# EAGLE design PCB-CARDLOCK (EAGLE 6.5.0)

## Sheet 1 of 2
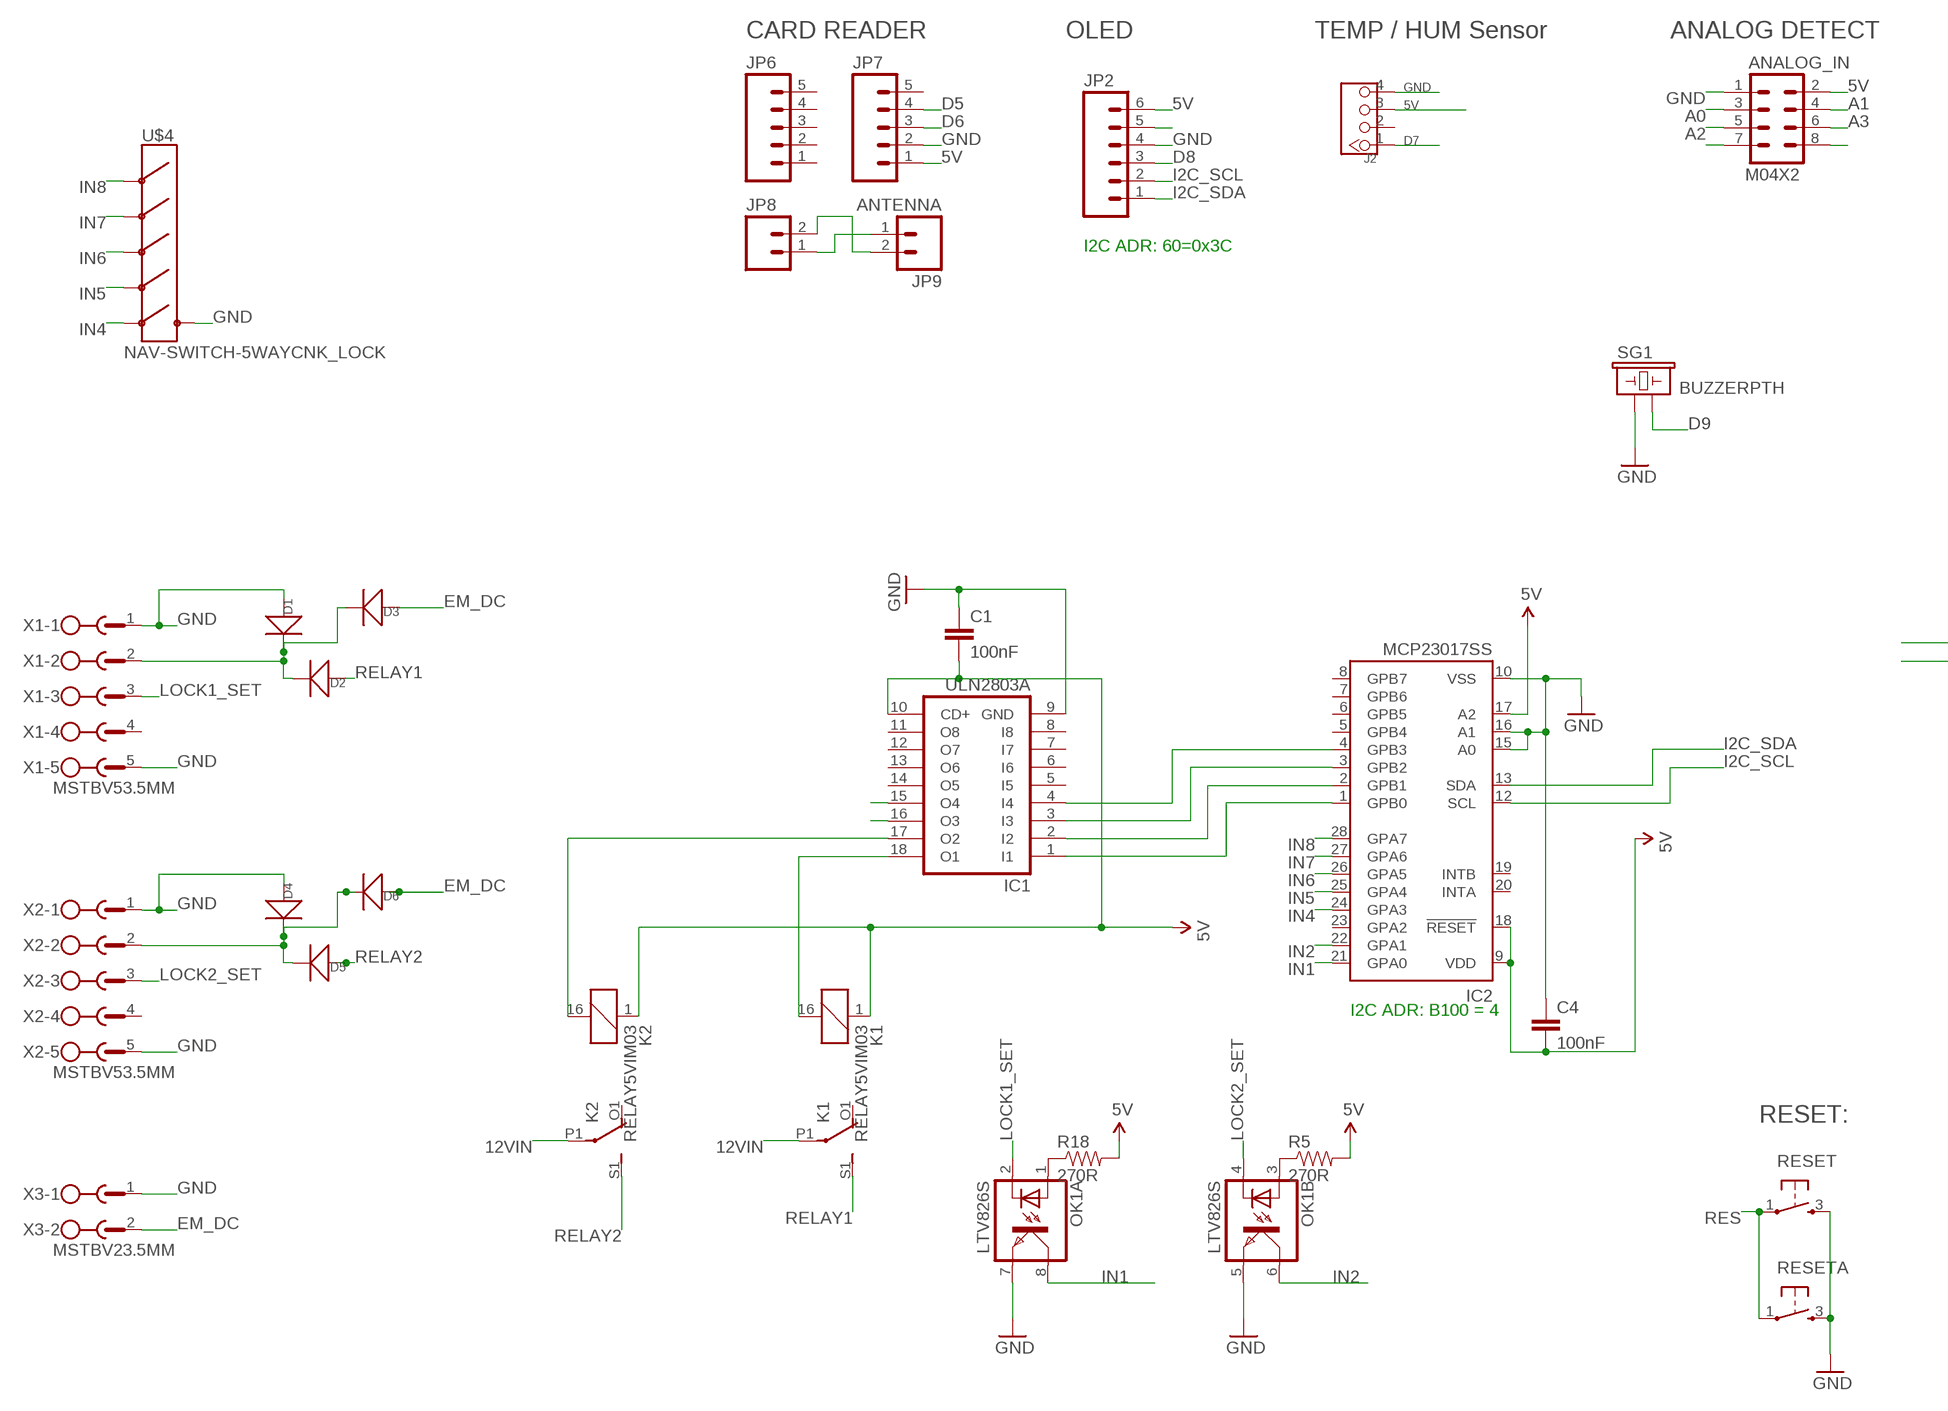
[diagram p0: schematic, sheet 1, part 1 of 2]
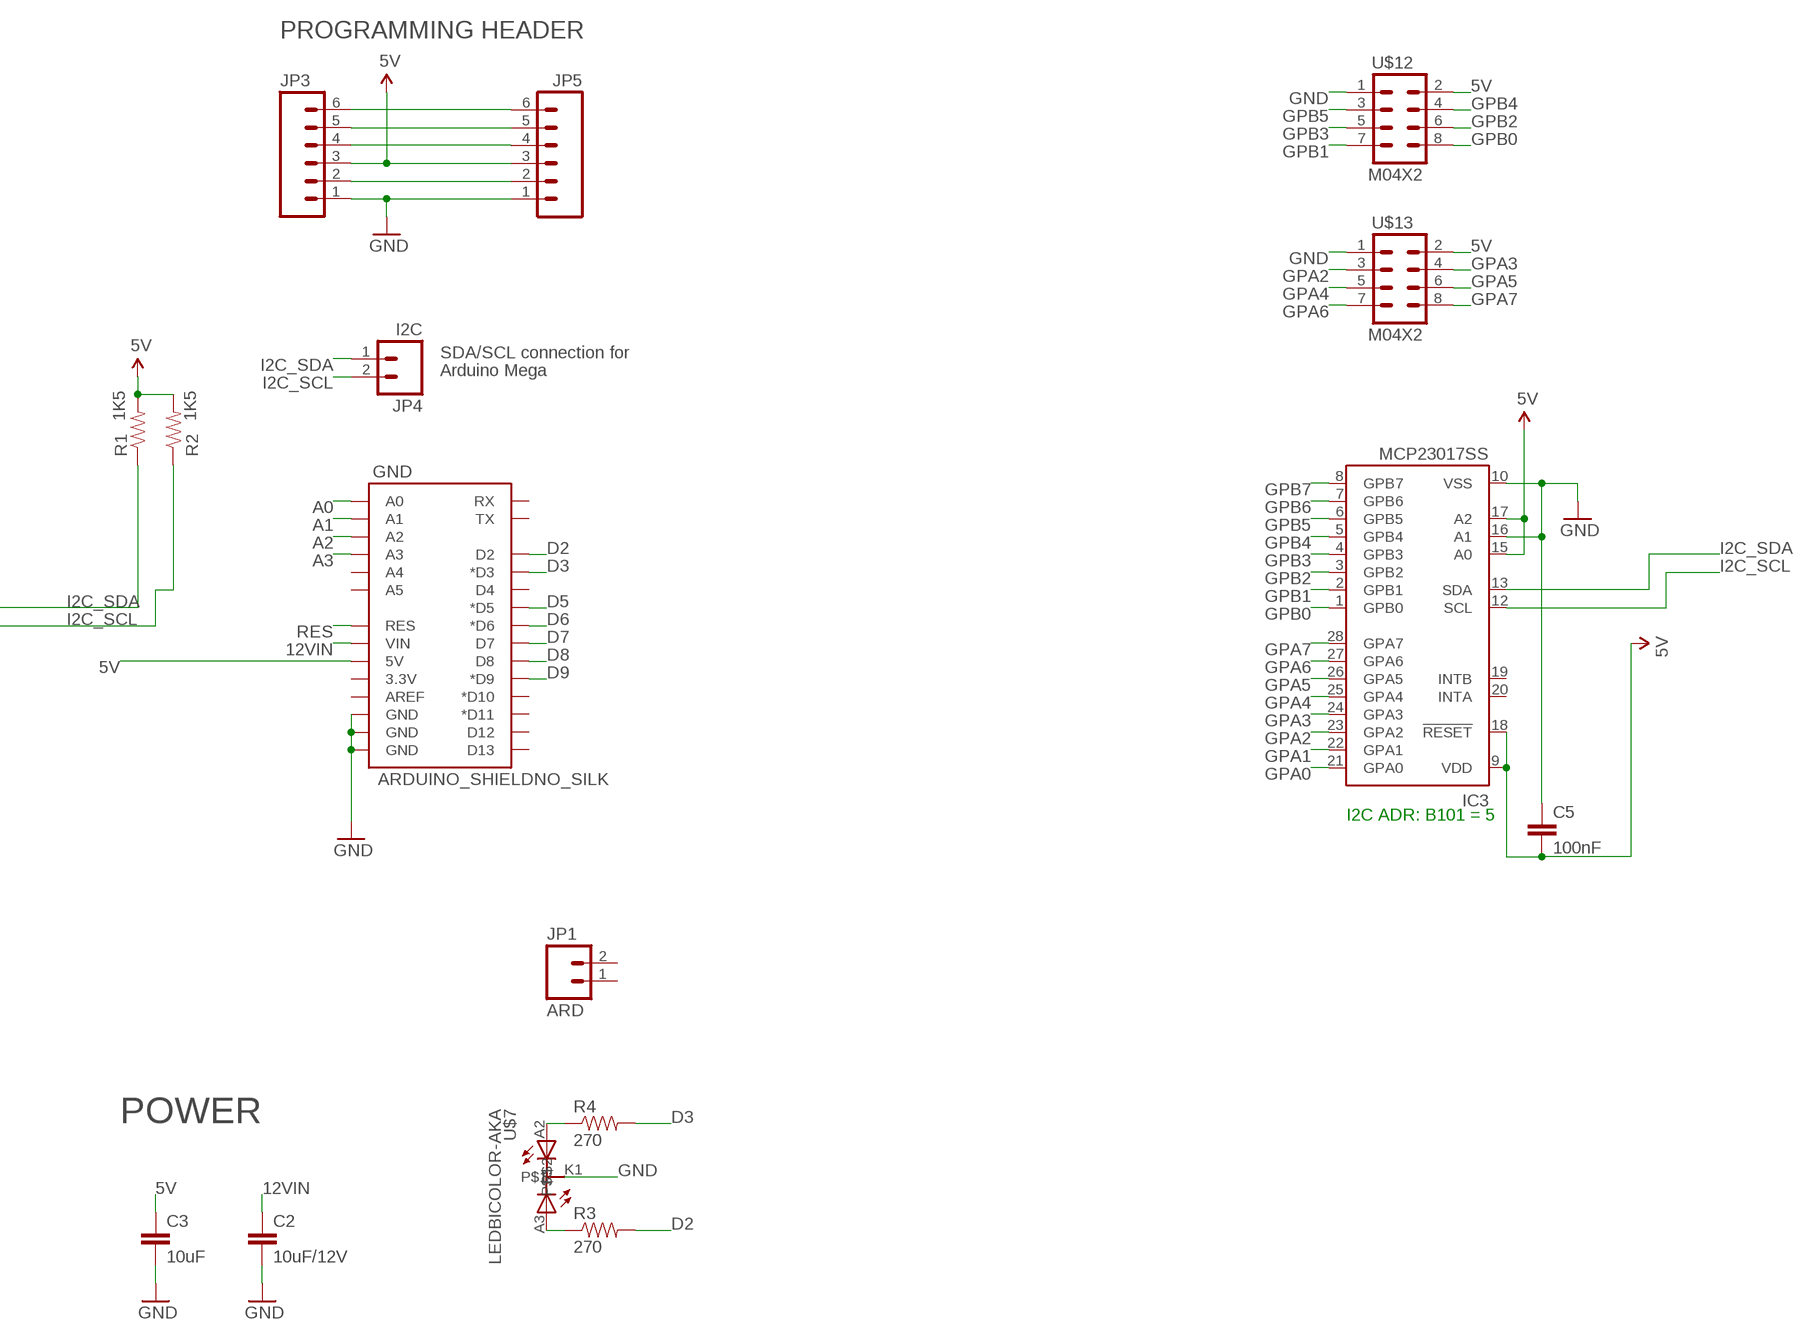
[diagram p1: schematic, sheet 1, part 2 of 2]

### Parts
ANALOG_IN  M04X2  [2X4]
C1  100nF  CAP0805  [0805]
C2  10uF/12V  CAP0805  [0805]
C3  10uF  CAP0805  [0805]
C4  100nF  CAP0603-CAP  [0603-CAP]
C5  100nF  CAP0603-CAP  [0603-CAP]
D1  D-SMA  [DO-214AC]
D2  D-SMA  [DO-214AC]
D3  D-SMA  [DO-214AC]
D4  D-SMA  [DO-214AC]
D5  D-SMA  [DO-214AC]
D6  D-SMA  [DO-214AC]
GND  ARDUINO_SHIELDNO_SILK  [DUEMILANOVE_VIAS]
IC1  ULN2803A  ULN2803ASO18W  [SO18W]
IC2  MCP23017SS  [SSOP28]
IC3  MCP23017SS  [SSOP28]
J2  TWIG-4P-2.0-2.0  [4P-2.0]
JP1  ARD  M02PTH  [1X02]
JP2  M06POLAR  [MOLEX-1X6]
JP3  M06POLAR  [MOLEX-1X6]
JP4  I2C  M02PTH  [1X02]
JP5  M06POLAR  [MOLEX-1X6]
JP6  M05PTH  [1X05]
JP7  M05PTH  [1X05]
JP8  M02PTH  [1X02]
JP9  ANTENNA  M02PTH  [1X02]
K1  RELAY5VIM03  [DS2Y]
K2  RELAY5VIM03  [DS2Y]
OK1  LTV826S  [DIL8-SMD]
R1  1K5  RESISTOR0603-RES  [0603-RES]
R2  1K5  RESISTOR0603-RES  [0603-RES]
R3  270  RESISTOR0603-RES  [0603-RES]
R4  270  RESISTOR0603-RES  [0603-RES]
R5  270R  RESISTOR0603-RES  [0603-RES]
R18  270R  RESISTOR0603-RES  [0603-RES]
RESET  TAC_SWITCH  [PUSHBUTTON]
RESETA  TAC_SWITCH  [PUSHBUTTON]
SG1  BUZZERPTH  [BUZZER-12MM]
U$4  NAV-SWITCH-5WAYCNK_LOCK  [NAV-SWITCH-5WAY]
U$7  LEDBICOLOR-AKA  [LED5MM-BICOLOR]
U$12  M04X2  [2X4]
U$13  M04X2  [2X4]
X1  MSTBV53.5MM  [MSTBV5-3.5]
X2  MSTBV53.5MM  [MSTBV5-3.5]
X3  MSTBV23.5MM  [MSTBV2-3.5]

### Nets
5V [PWR]: ANALOG_IN.2 C1.2 C3.1 C4.2 C5.2 GND.5V IC1.10(CD+) IC2.9(VDD) IC2.17(A2) IC2.18(!RESET) IC3.9(VDD) IC3.15(A0) IC3.17(A2) IC3.18(!RESET) J2.3 JP2.6 JP3.3 JP5.3 JP7.1 K1.1 K2.1 R1.2 R2.2 R5.2 R18.2 U$12.2 U$13.2
12VIN [PWR]: C2.1 GND.VIN K1.P1(2:P) K2.P1(2:P)
A0: ANALOG_IN.3 GND.A0
A1: ANALOG_IN.4 GND.A1
A2: ANALOG_IN.5 GND.A2
A3: ANALOG_IN.6 GND.A3
D2: GND.D2 R3.2
D3: GND.D3(*D3) R4.2
D5: GND.D5(*D5) JP7.4
D6: GND.D6(*D6) JP7.3
D7: GND.D7 J2.1
D8: GND.D8 JP2.3
D9: GND.D9(*D9) SG1.-
EM_DC [RELAY LINES]: D3.1(+) D6.1(+) X3.2
GND [PWR]: ANALOG_IN.1 C1.1 C2.2 C3.2 C4.1 C5.1 D1.1(+) D4.1(+) GND.GND@0(GND) GND.GND@1(GND) GND.GND@2(GND) IC1.9(GND) IC2.10(VSS) IC2.15(A0) IC2.16(A1) IC3.10(VSS) IC3.16(A1) J2.4 JP2.4 JP3.1 JP5.1 JP7.2 OK1.5(B:EMIT) OK1.7(A:EMIT) RESET.3 RESETA.3 SG1.+ U$4.PIN4(COMMON) U$7.K1 U$12.1 U$13.1 X1.1 X1.5 X2.1 X2.5 X3.1
GPA0: IC3.21(GPA0)
GPA1: IC3.22(GPA1)
GPA2: IC3.23(GPA2) U$13.3
GPA3: IC3.24(GPA3) U$13.4
GPA4: IC3.25(GPA4) U$13.5
GPA5: IC3.26(GPA5) U$13.6
GPA6: IC3.27(GPA6) U$13.7
GPA7: IC3.28(GPA7) U$13.8
GPB0: IC3.1(GPB0) U$12.8
GPB1: IC3.2(GPB1) U$12.7
GPB2: IC3.3(GPB2) U$12.6
GPB3: IC3.4(GPB3) U$12.5
GPB4: IC3.5(GPB4) U$12.4
GPB5: IC3.6(GPB5) U$12.3
GPB6: IC3.7(GPB6)
GPB7: IC3.8(GPB7)
I2C_SCL: IC2.12(SCL) IC3.12(SCL) JP2.2 JP4.2 R2.1
I2C_SDA: IC2.13(SDA) IC3.13(SDA) JP2.1 JP4.1 R1.1
IN1: IC2.21(GPA0) OK1.8(A:COL)
IN2: IC2.22(GPA1) OK1.6(B:COL)
IN4: IC2.24(GPA3) U$4.PIN6(PUSH)
IN5: IC2.25(GPA4) U$4.PIN5(RIGHT)
IN6: IC2.26(GPA5) U$4.PIN2(LEFT)
IN7: IC2.27(GPA6) U$4.PIN3(DWN)
IN8: IC2.28(GPA7) U$4.PIN1(UP)
LOCK1_SET [PWR]: OK1.2(A:C) X1.3
LOCK2_SET [PWR]: OK1.4(B:C) X2.3
N$1 [RELAY LINES]: D1.2(-) D2.2(-) D3.2(-) X1.2
N$2: JP8.1 JP9.1
N$3: JP3.4 JP5.4
N$4: IC1.18(O1) K1.16
N$5 [RELAY LINES]: D4.2(-) D5.2(-) D6.2(-) X2.2
N$6: IC1.1(I1) IC2.1(GPB0)
N$7: R4.1 U$7.A2
N$8: JP3.5 JP5.5
N$9: IC1.17(O2) K2.16
N$10: JP8.2 JP9.2
N$11: R3.1 U$7.A3
N$12: JP3.2 JP5.2
N$13: IC1.2(I2) IC2.2(GPB1)
N$14: IC1.3(I3) IC2.3(GPB2)
N$15: JP2.5
N$16: IC1.4(I4) IC2.4(GPB3)
N$17: ANALOG_IN.8
N$20: OK1.3(B:A) R5.1
N$21: ANALOG_IN.7
N$23: OK1.1(A:A) R18.1
N$25: IC1.16(O3)
N$26: IC1.15(O4)
N$45: JP3.6 JP5.6
RELAY1 [RELAY LINES]: D2.1(+) K1.S1(2:S)
RELAY2 [RELAY LINES]: D5.1(+) K2.S1(2:S)
RES: GND.RES RESET.1 RESETA.1
Unconnected: GND.3.3V GND.A4 GND.A5 GND.AREF GND.D4 GND.D10(*D10) GND.D11(*D11) GND.D12 GND.D13 GND.RX GND.TX IC1.5(I5) IC1.6(I6) IC1.7(I7) IC1.8(I8) IC1.11(O8) IC1.12(O7) IC1.13(O6) IC1.14(O5) IC2.5(GPB4) IC2.6(GPB5) IC2.7(GPB6) IC2.8(GPB7) IC2.19(INTB) IC2.20(INTA) IC2.23(GPA2) IC3.19(INTB) IC3.20(INTA) J2.2 JP1.1 JP1.2 JP6.1 JP6.2 JP6.3 JP6.4 JP6.5 JP7.5 K1.O1(2:O) K1.O2(3:O) K1.P2(3:P) K1.S2(3:S) K2.O1(2:O) K2.O2(3:O) K2.P2(3:P) K2.S2(3:S) X1.4 X2.4

### Notes on the sheet
- CARD READER | OLED | TEMP / HUM Sensor | ANALOG DETECT
- PROGRAMMING HEADER
- I2C ADR: 60=0x3C
- SDA/SCL connection for
- Arduino Mega
- I2C ADR: B101 = 5
- I2C ADR: B100 = 4
- RESET:
- POWER

## Sheet 2 of 2

## Library data of the parts
ANALOG_IN U$12 U$13 = SparkFun:M04X2
C1-C5 = SparkFun:CAP: Capacitor Standard 0603 ceramic capacitor, and 0.1" leaded capacitor.
D1-D6 = OPL:D*: DIODE
GND = SparkFun:ARDUINO_SHIELD
IC1 = uln-udn:ULN2803A: DRIVER ARRAY
IC2 IC3 = microchip:MCP23017: http://ww1.microchip.com/downloads/en/DeviceDoc/21952a.pdf Source: http://ww1.microchip.com/downloads/en/DeviceDoc/21952a.pdf; MF: MICROCHIP; MPN: MCP23017-E/SS; OC_FARNELL: 1467674; OC_NEWARK: 31K2960
J2 = Connector :TWIG-4P-2.0
JP1 JP4 JP8 JP9 = SparkFun:M02: Header 2 Standard 2-pin 0.1" header. Use with straight break away headers (SKU : PRT-00116), right angle break away headers (PRT-00553), swiss pins (PRT-00743), machine pins (PRT-00117), and female headers (PRT-00115). Molex polarized connector foot print use with SKU : PRT-08233 with associated crimp pins and housings.
JP2 JP3 JP5 = SparkFun:M06: Header 6 Standard 6-pin 0.1" header. Use with straight break away headers (SKU : PRT-00116), right angle break away headers (PRT-00553), swiss pins (PRT-00743), machine pins (PRT-00117), and female headers (PRT-00115). Molex polarized connector foot print use with SKU : PRT-08094 with associated crimp pins and housings. NOTES ON THE VARIANTS LOCK and LOCK_LONGPADS... This footprint was designed to help hold the alignment of a through-hole component (i.e. 6-pin header) while soldering it into place. You may notice that each hole has been shifted either up or down by 0.005 of an inch from it's more standard position (which is a perfectly straight line). This slight alteration caused the pins (the squares in the middle) to touch the edges of the holes. Because they are alternating, it causes a "brace" to hold the component in place. 0.005 has proven to be the perfect amount of "off-center" position when using our standard breakaway headers. Although looks a little odd when you look at the bare footprint, once you have a header in there, the alteration is very hard to notice. Also, if you push a header all the way into place, it is covered up entirely on the bottom side. This idea of altering the position of holes to aid alignment will be further integrated into the Sparkfun Library for other footprints. It can help hold any component with 3 or more connection pins.
JP6 JP7 = SparkFun:M05: Header 5 Standard 5-pin 0.1" header. Use with straight break away headers (SKU : PRT-00116), right angle break away headers (PRT-00553), swiss pins (PRT-00743), machine pins (PRT-00117), and female headers (PRT-00115). Molex polarized connector foot print use with SKU : PRT-08230 with associated crimp pins and housings.
K1 K2 = SKAARHOJ:RELAY5V: RELAY 2 x switch, AxiCom 150 mW 5V
OK1 = optocoupler:LTV826: OPTO COUPLER Source: LITEON, LTV816.pdf; OC_FARNELL: unknown; OC_NEWARK: unknown
R1-R5 R18 = SparkFun:RESISTOR: Resistor Basic schematic elements and footprints for 0603, 1206, and PTH resistors.
RESET RESETA = SKAARHOJ:TAC_SWITCH: Momentary Switch Button commonly used for reset or general input. Spark Fun Electronics SKU : COM-00097
SG1 = SKAARHOJ:BUZZER: Buzzer 12mm Spark Fun Electronics SKU : Comp-Buzzer
U$4 = SKAARHOJ:NAV-SWITCH-5WAY: For use with a push-button switch made by CnK components. The Part # is
U$7 = SKAARHOJ:LEDBICOLOR-AKA
X1 X2 = SKAARHOJ:MSTBV5: PHOENIX
X3 = SKAARHOJ:MSTBV2: PHOENIX

## Net classes
0 default: width 0.203 mm, drill 0.406 mm, clearance 0.203 mm
1 PWR: width 0.406 mm, drill 0.61 mm, clearance 0.203 mm
2 RELAY LINES: width 0.305 mm, clearance 0.203 mm
3 INput lines: clearance 0.203 mm

## Board
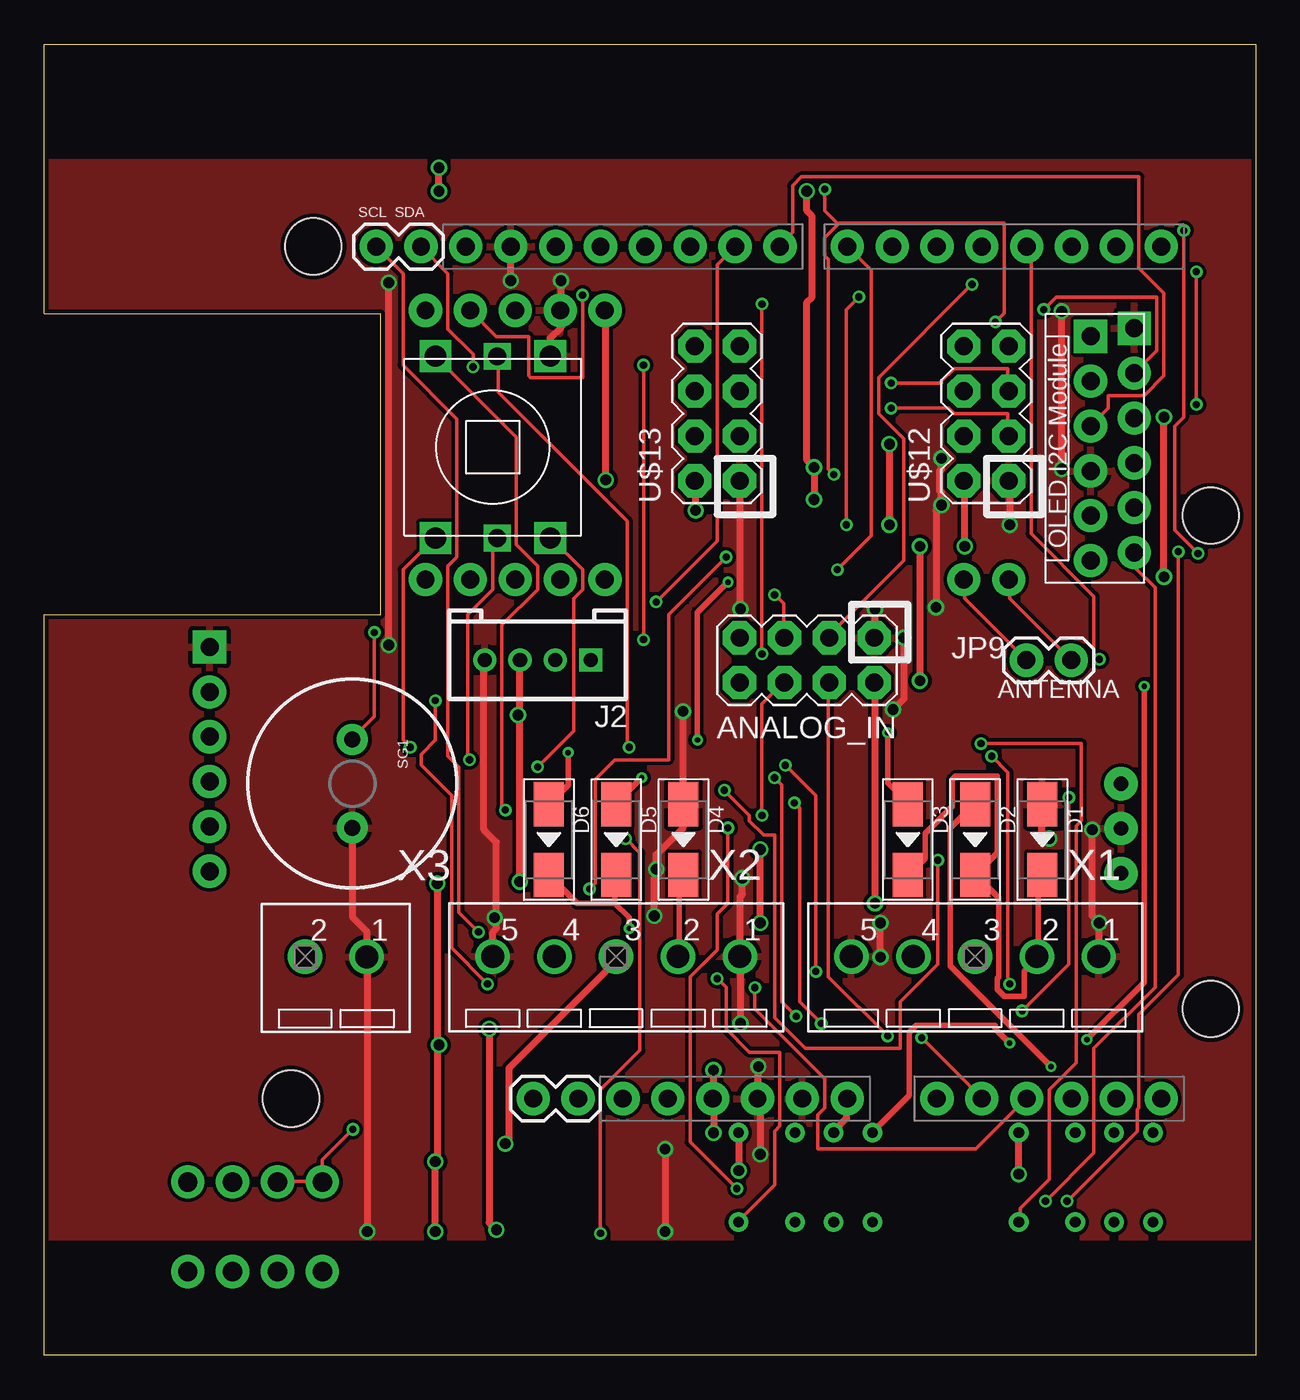
[diagram p2: board, top side]
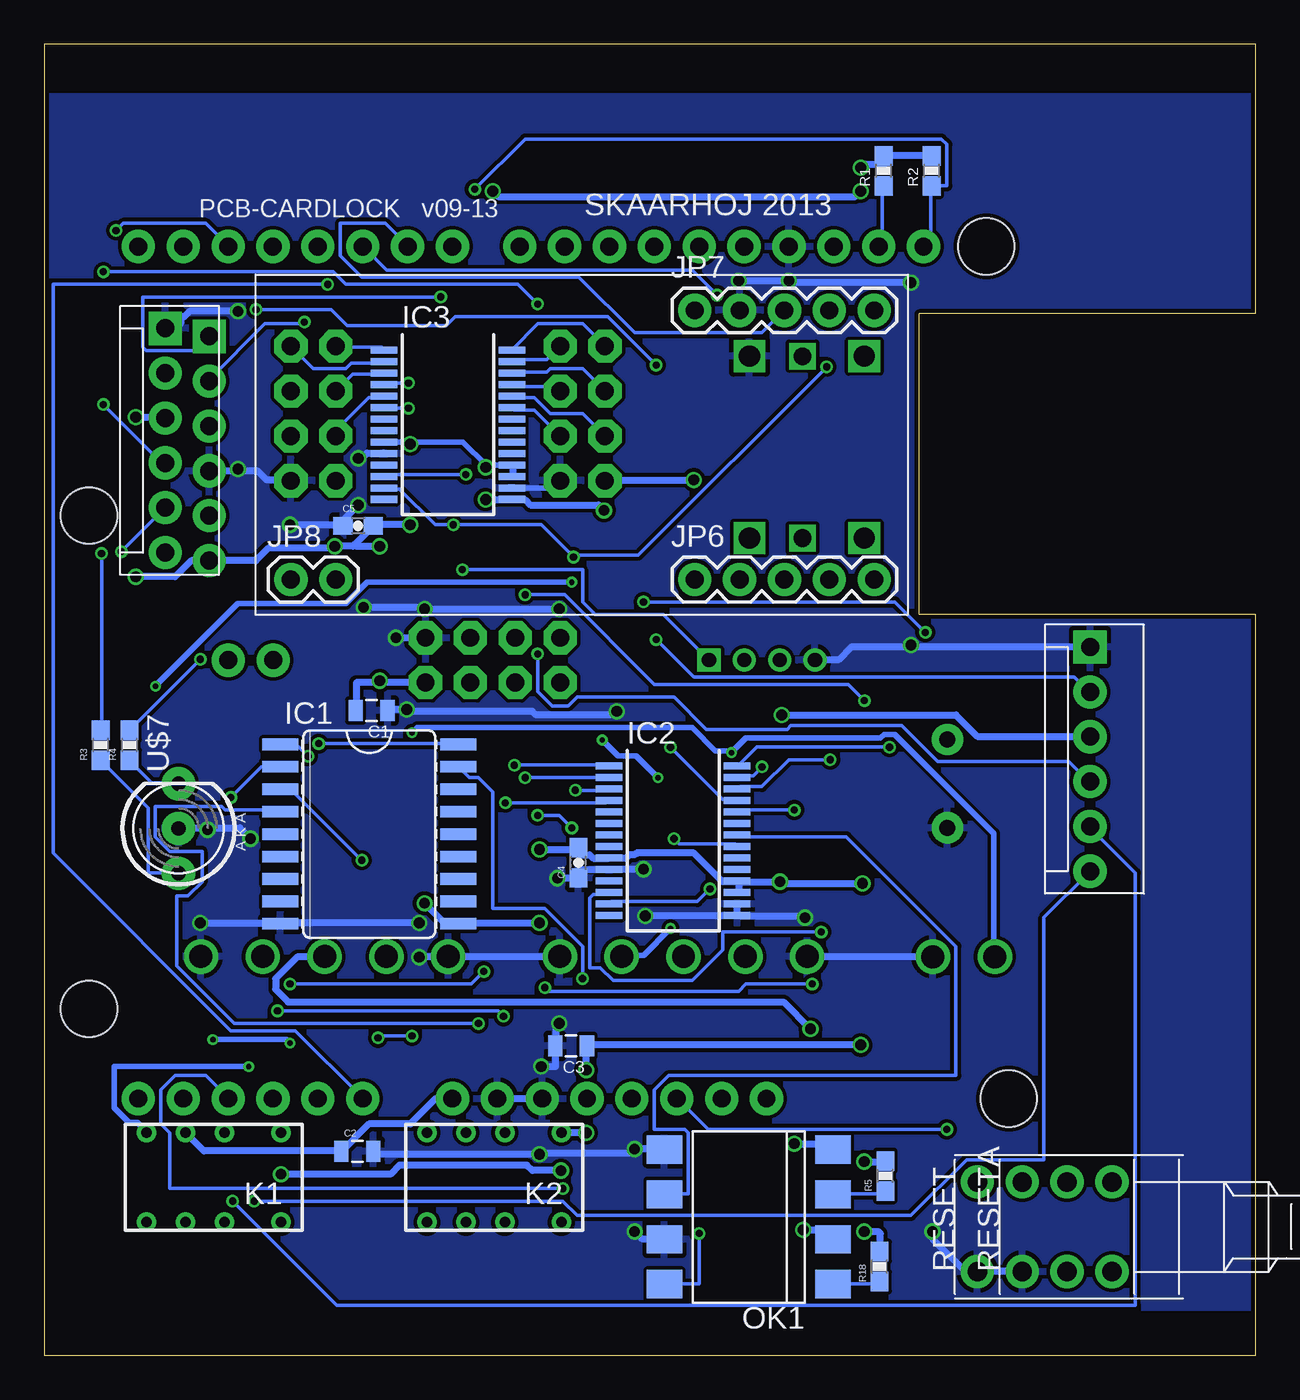
[diagram p3: board, bottom side, seen from below]

Size 68.58 x 74.26 mm. Coordinates in mm from the lower left corner, seen from the top.
Outline: 0,0 0,41.96 19.05,41.96 19.05,58.99 0,58.99 0,74.26 68.58,74.26 68.58,0 0,0
Copper layers (1*16): Top 0.035mm / dielectric 1.5mm / Bottom 0.035mm
Design rules "Fusion_eagle_rule_v1.1": minimum track width 6mil, minimum drill 12mil, track to track 6mil, track to pad 6mil, pad to pad 6mil, via to via 6mil, smd to smd 0mil, copper to edge 10mil, drill to drill 10mil, minimum pad ring 10mil, minimum via ring 6mil, stop-mask expansion 2mil, vias tented up to drill 100mil, thermal gap 10mil
Holes 3.2 mm at 66.04,47.56 15.24,62.8 13.97,14.54 66.04,19.62
tRestrict: area 0,0 to 68.6,6.5; area 0,67.8 to 68.6,74.3
bRestrict: area 0,71.5 to 68.6,74.3; area 0,0 to 68.6,2.5

### Footprints (pad centres in the part's own frame; a part is rotated, then mirrored left to right if it is on the bottom)
2X4 = drill 1.016 pad 1.88 octagon: 1 -3.81,-1.27; 2 -3.81,1.27; 3 -1.27,-1.27; 4 -1.27,1.27; 5 1.27,-1.27; 6 1.27,1.27; 7 3.81,-1.27; 8 3.81,1.27
0805 = smd 0.8 x 1.2: 1 -0.9,0; 2 0.9,0
0603-CAP = smd 1.1 x 1: 1 -0.85,0; 2 0.85,0
DO-214AC = smd 2.5 x 1.7: 1 -2,0; 2 2,0
DUEMILANOVE_VIAS = drill 1.016 pad 1.88: 3.3V 50.8,13.97; 5V 50.8,16.51; A0 50.8,29.21; A1 50.8,31.75; A2 50.8,34.29; A3 50.8,36.83; A4 50.8,39.37; A5 50.8,41.91; AREF 2.54,2.54; D2 2.54,36.83; D3 2.54,34.29; D4 2.54,31.75; D5 2.54,29.21; D6 2.54,26.67; D7 2.54,24.13; D8 2.54,20.32; D9 2.54,17.78; D10 2.54,15.24; D11 2.54,12.7; D12 2.54,10.16; D13 2.54,7.62; GND@0 50.8,19.05; GND@1 50.8,21.59; GND@2 2.54,5.08; RES 50.8,11.43; RX 2.54,41.91; TX 2.54,39.37; VIN 50.8,24.13
SO18W = smd 0.66 x 2.032: 1 -5.08,-5.029; 2 -3.81,-5.029; 3 -2.54,-5.029; 4 -1.27,-5.029; 5 0,-5.029; 6 1.27,-5.029; 7 2.54,-5.029; 8 3.81,-5.029; 9 5.08,-5.029; 10 5.08,5.029; 11 3.81,5.029; 12 2.54,5.029; 13 1.27,5.029; 14 0,5.029; 15 -1.27,5.029; 16 -2.54,5.029; 17 -3.81,5.029; 18 -5.08,5.029
SSOP28 = smd 0.4 x 1.5: 1 -4.225,-3.625; 2 -3.575,-3.625; 3 -2.925,-3.625; 4 -2.275,-3.625; 5 -1.625,-3.625; 6 -0.975,-3.625; 7 -0.325,-3.625; 8 0.325,-3.625; 9 0.975,-3.625; 10 1.625,-3.625; 11 2.275,-3.625; 12 2.925,-3.625; 13 3.575,-3.625; 14 4.225,-3.625; 15 4.225,3.625; 16 3.575,3.625; 17 2.925,3.625; 18 2.275,3.625; 19 1.625,3.625; 20 0.975,3.625; 21 0.325,3.625; 22 -0.325,3.625; 23 -0.975,3.625; 24 -1.625,3.625; 25 -2.275,3.625; 26 -2.925,3.625; 27 -3.575,3.625; 28 -4.225,3.625
4P-2.0 = drill 0.8 pad 1.27 square: 1 -3,0 | drill 0.8 pad 1.27: 2 -1,0; 3 1,0; 4 3,0
1X02 = drill 1.016 pad 1.88: 1 0,0; 2 2.54,0
MOLEX-1X6 = drill 1.016 pad 1.88 square: 1 0,0 | drill 1.016 pad 1.88: 2 2.54,0; 3 5.08,0; 4 7.62,0; 5 10.16,0; 6 12.7,0
1X05 = drill 1.016 pad 1.88: 1 0,0; 2 2.54,0; 3 5.08,0; 4 7.62,0; 5 10.16,0
DS2Y = drill 0.6: 1 1.2,0.46; 16 1.2,5.54; O1 4.4,0.46; O2 4.4,5.54; P1 6.6,0.46; P2 6.6,5.54; S1 8.8,0.46; S2 8.8,5.54
DIL8-SMD = smd 1.6 x 2: 1 -3.81,-4.77; 2 -1.27,-4.77; 3 1.27,-4.77; 4 3.81,-4.77; 5 3.81,4.77; 6 1.27,4.77; 7 -1.27,4.77; 8 -3.81,4.77
0603-RES = smd 1.1 x 1: 1 -0.85,0; 2 0.85,0
PUSHBUTTON = drill 1.1 pad 1.88: 1 2.54,2.54; 2 2.54,-2.54; 3 -2.54,2.54; 4 -2.54,-2.54
BUZZER-12MM = drill 0.9 pad 1.778: + 2.5,0; - -2.5,0
NAV-SWITCH-5WAY = drill 1.2 square: PIN1 -5.15,3.25; PIN3 -5.15,-3.25; PIN4 5.15,-3.25; PIN6 5.15,3.25 | drill 1 square: PIN2 -5.15,-0.25; PIN5 5.15,-0.25
LED5MM-BICOLOR = drill 0.813 pad 1.88: A2 2.54,0; A3 -2.54,0; K1 0,0
MSTBV5-3.5 = drill 1.3: 1 -7,0; 2 -3.5,0; 3 0,0; 4 3.5,0; 5 7,0
MSTBV2-3.5 = drill 1.3: 1 -1.75,0.02; 2 1.75,0.02

### Placement (x,y rotation side)
ANALOG_IN  43.18,39.37 180 top
C1  50.04,36.52 180 bottom
C2  50.85,11.55 0 bottom
C3  38.75,17.53 180 bottom
C4  38.34,27.89 90 bottom
C5  50.8,46.99 0 bottom
D1  56.52,29.21 270 top
D2  52.7,29.21 270 top
D3  48.9,29.21 270 top
D4  36.2,29.21 270 top
D5  32.38,29.21 270 top
D6  28.57,29.21 270 top
GND  21.34,65.34 270 top
IC1  50.17,29.52 270 bottom
IC2  32.97,29.14 270 bottom
IC3  45.72,52.7 270 bottom
J2  27.94,39.37 180 top
JP1  27.69,14.54 0 top
JP2  59.24,57.71 270 top
JP3  61.72,58.17 270 bottom
JP4  21.34,62.8 180 top
JP5  9.36,40.12 270 bottom
JP6  31.75,43.94 0 bottom
JP7  31.75,59.18 0 bottom
JP8  54.61,43.94 0 bottom
JP9  58.15,39.37 180 top
K1  53.98,13.08 180 bottom
K2  38.1,13.08 180 bottom
OK1  28.69,7.84 90 bottom
R1  21.05,67.09 90 bottom
R2  18.33,67.09 90 bottom
R3  65.38,34.56 90 bottom
R4  63.74,34.56 90 bottom
R5  20.95,10.16 90 bottom
R18  21.29,5.03 90 bottom
RESET  13.21,7.29 90 bottom
RESETA  10.67,7.29 90 bottom
SG1  17.45,32.38 270 top
U$4  25.4,51.44 90 top
U$7  60.97,29.84 90 bottom
U$12  53.34,53.34 90 top
U$13  38.1,53.34 90 top
X1  52.7,22.59 180 top
X2  32.38,22.59 180 top
X3  16.51,22.59 180 top

### Tracks (layer width: path | path; a pad name or v marks a point on that pad's centre or on a via)
5V  (via drill 0.61)
  Top 0.406: v47.85,51.61 v47.85,47.04 | v43.59,48.46 v43.59,50.29 43.18,50.7 43.18,59.64 43.48,59.94 43.48,64.52 43.18,64.82 v43.18,65.94 | v22.35,65.94 v22.35,67.26 | v36.88,47.85 36.88,49.48 U$13.2 | v52.12,45.82 52.12,49.48 U$12.2 | v63.4,44.09 v63.4,53.14 | v31.8,49.58 31.8,59.13 JP7.1 | v49.58,45.82 v49.58,38.2 | v37.9,16.15 37.9,14.63 GND.5V 37.9,14.43 v37.9,12.6 | v55.17,10.26 55.17,12.6 K1.1 | v39.32,10.46 39.32,12.6 K2.1 | v40.54,24.49 v40.54,28.65 | v22.15,7.01 v22.15,10.97 22.25,11.07 22.25,17.58 | v26.92,26.82 26.92,36.27 | 26.92,36.27 26.92,39.32 J2.3 | v22.25,26.72 22.25,17.58 | v26.82,36.27 26.92,36.27 | v22.35,17.58 22.25,17.58 | v47.04,25.6 47.04,38.1 ANALOG_IN.2
  Bottom 0.305: IC3.9 47.85,51.73 44.87,51.73 43.56,50.42 42.11,50.42 IC3.18
  Bottom 0.406: ANALOG_IN.2 49.58,38.1 | 49.58,38.1 50.9,38.1 50.9,36.58 C1.2 | R2.2 18.39,67.97 20.93,67.97 21.03,68.07 21.13,67.97 R1.2 21.03,67.77 21.03,67.46 22.15,67.46 v22.35,67.26 | v47.85,47.04 49.89,47.04 C5.2 49.99,46.84 50.09,46.84 51,45.92 | v47.85,51.61 47.85,51.73 | v43.59,48.46 42.16,48.46 IC3.15 41.96,48.46 41.35,48.46 41.05,48.16 37.19,48.16 v36.88,47.85 | v43.59,50.29 43.56,50.42 | IC3.17 42.06,49.78 42.06,50.29 IC3.18 | v22.35,65.94 22.66,65.63 42.88,65.63 v43.18,65.94 | 51,45.92 51.1,45.82 v52.12,45.82 52.22,45.72 55.88,45.72 56.59,45.01 JP2.6 59.44,45.01 60.25,45.01 61.16,44.09 v63.4,44.09 | v63.4,53.14 61.77,53.14 JP3.3 | v31.8,49.58 36.78,49.58 U$13.2 | v49.58,45.82 50.9,45.82 51,45.92 | v49.58,38.2 49.58,38.1 | v37.9,16.15 37.9,17.48 C3.1 37.69,17.58 v22.35,17.58 | v37.9,12.6 39.22,12.6 K2.1 | v55.17,10.26 48.97,10.26 48.46,10.77 41.25,10.77 40.95,10.46 v39.32,10.46 | v40.54,28.65 38.41,28.65 C4.2 38.41,28.45 38.3,28.45 38.2,28.35 37.69,28.35 37.49,28.14 36.68,28.14 IC2.9 36.47,28.14 35.66,28.14 35.46,28.35 35.15,28.35 35.05,28.45 31.8,28.45 30.18,26.82 29.46,26.82 IC2.18 29.26,26.82 | v40.54,24.49 45.11,24.49 IC1.10 45.31,24.49 45.92,24.49 v47.04,25.6 | v22.15,10.97 21.03,10.97 R5.2 | v22.15,7.01 21.34,7.01 21.23,6.91 21.23,5.89 R18.2 | 29.26,26.82 v26.92,26.82 26.82,26.72 v22.25,26.72 | 29.26,26.82 29.26,26.31 IC2.17 | v26.82,36.27 16.97,36.27 15.75,35.05 9.45,35.05 JP5.3
12VIN
  Top 0.406: K2.P1 44.7,12.7 45.41,13.41 45.41,14.53 GND.VIN
  Bottom 0.406: GND.VIN 45.52,14.53 46.43,14.53 47.85,13.11 50.19,13.11 51.71,11.58 C2.1 51.92,11.58 59.54,11.58 60.55,12.6 K1.P1
A0  (via drill 0.41)
  Top 0.203: v52.53,60.66 47.24,55.37 47.24,53.34 48.67,51.92 48.67,45.01 44.5,40.84 44.5,40.64 ANALOG_IN.3
  Bottom 0.203: v52.53,60.66 68.07,60.66 68.07,28.45 58.01,18.39 54.36,18.39 50.6,14.63 GND.A0
A1  (via drill 0.41)
  Top 0.203: v49.68,17.98 53.03,14.63 GND.A1 | v47.75,18.09 44.4,21.44 44.4,38.1 ANALOG_IN.4
  Bottom 0.203: v49.68,17.98 49.58,18.09 v47.75,18.09
A2  (via drill 0.41)
  Top 0.203: v40.23,20.83 40.23,19.61 44.2,15.65 44.2,14.02 43.79,13.61 43.79,11.68 52.73,11.68 55.58,14.53 GND.A2 | v25.09,21.03 23.06,23.06 23.06,31.7 21.34,33.43 21.34,34.04 22.15,34.85 v22.15,37.08 | v41.35,43.08 41.86,42.57 41.86,40.64 ANALOG_IN.5
  Bottom 0.203: v40.23,20.83 40.03,20.62 29.26,20.62 28.85,21.03 v25.09,21.03 | v22.15,37.08 23.06,38 34.04,38 39.12,43.08 v41.35,43.08
A3  (via drill 0.41)
  Top 0.203: v39.22,9.45 36.58,12.09 36.58,21.44 38.1,22.96 38.1,24.99 38.71,25.6 v38.71,29.87 | v40.64,30.58 40.64,36.88 41.86,38.1 ANALOG_IN.6
  Bottom 0.203: v39.22,9.45 61.47,9.45 61.47,12.6 61.98,13.11 61.98,15.04 61.16,15.85 59.44,15.85 58.22,14.63 GND.A3 | v38.71,29.87 39.42,30.58 v40.64,30.58
D2  (via drill 0.41)
  Top 0.203: v65.33,45.41 64.01,46.74 64.01,52.63 64.52,53.14 v64.52,63.7
  Bottom 0.203: v65.33,45.41 65.33,35.46 R3.2 | v64.52,63.7 64.11,64.11 59.44,64.11 58.22,62.89 GND.D2
D3  (via drill 0.41)
  Top 0.203: v59.74,39.42 59.44,39.73 59.44,42.98 55.88,46.53 55.88,62.59 55.68,62.79 GND.D3
  Bottom 0.203: v59.74,39.42 63.7,35.46 R4.2
D5  (via drill 0.41)
  Top 0.203: JP7.4 25.6,57.71 27.43,57.71 27.43,55.47 27.53,55.37 30.48,55.37 v30.48,60.05
  Bottom 0.203: v30.48,60.05 31.9,61.47 49.17,61.47 50.49,62.79 GND.D5
D6
  Bottom 0.203: JP7.3 27.94,57.91 35.15,57.91 38.3,61.06 50.6,61.06 51.82,62.28 51.82,64.11 49.28,64.11 48.06,62.89 GND.D6
D7  (via drill 0.41)
  Top 0.203: v44.91,44.5 46.84,46.43 46.84,61.47 45.52,62.79 GND.D7
  Bottom 0.203: v44.91,44.5 38.1,44.5 38.1,42.67 37.39,41.96 33.53,41.96 30.99,39.42 J2.1
D8
  Top 0.203: GND.D8 41.66,62.89 42.37,63.6 42.37,66.24 42.88,66.75 61.98,66.75 61.98,61.57 63.4,60.15 63.4,55.47 62.28,54.36 60.25,54.36 60.25,53.65 59.33,52.73 JP2.3
D9  (via drill 0.41)
  Top 0.203: v18.69,40.95 18.69,36.17 17.48,34.95 SG1.- | v34.65,42.67 38.1,46.13 38.1,61.77 GND.D9
  Bottom 0.203: v18.69,40.95 20.42,42.67 v34.65,42.67
EM_DC  (via drill 0.3)
  Top 0.305: v29.67,34.14 29.67,32.31 28.65,31.29 D6.1 | v47.75,35.26 47.75,32.41 48.87,31.29 D3.1
  Bottom 0.305: X3.2 14.83,22.66 14.83,29.57 20.42,35.15 21.03,35.15 21.23,34.95 28.85,34.95 v29.67,34.14 29.77,34.24 30.58,34.24 31.9,35.56 47.45,35.56 v47.75,35.26
GND  (via drill 0.61)
  Top 0.406: U$4.PIN4 28.65,57.61 29.26,58.22 29.26,59.13 JP7.2 29.26,59.33 v29.26,60.86 | v26.42,60.86 GND.GND@2 | 25.6,24.79 25.6,24.18 25.4,23.98 25.4,22.66 X2.5 | 25.6,24.79 25.6,29.06 24.89,29.77 24.89,39.32 J2.4 | SG1.+ 17.48,29.87 17.48,24.79 18.29,23.98 18.29,22.66 X3.1 18.29,22.45 v18.29,7.01 | v19.51,40.23 v19.51,60.76 | v48.06,36.58 48.67,37.19 v48.67,40.64 | v39.42,42.27 39.42,49.48 U$13.1 | v47.04,42.27 47.04,40.64 ANALOG_IN.1 | v54.66,47.04 54.66,49.48 U$12.1 | v50.8,50.8 50.8,50.19 50.7,50.09 50.7,48.97 50.8,48.87 v50.8,48.16 50.49,47.85 v50.49,42.37 | v57.61,50.19 v57.61,59.13 | v35.15,11.68 v35.15,7.01 | v40.44,16.36 40.44,14.63 GND.GND@0 40.44,14.43 40.44,13.82 40.54,13.72 v40.54,11.38 | v56.9,29.26 56.49,29.67 56.49,31.19 D1.1 | X1.1 59.74,22.66 v59.74,24.49 59.33,24.89 v59.33,29.77 | v34.54,24.89 34.54,27.03 34.65,27.13 v34.65,27.53 34.65,28.35 36.17,29.87 36.17,31.19 D4.1 36.17,31.39 v36.17,36.47 | v39.52,27.03 39.52,26.11 39.42,26.01 39.42,22.66 X2.1 39.42,22.45 v39.42,18.8 | v47.35,22.55 v47.35,24.49 | v25.5,24.79 25.6,24.79
  Bottom 0.305: IC3.16 39.77,49.13 U$13.1
  Bottom 0.406: v29.26,60.86 v26.42,60.86 26.31,60.76 v19.51,60.76 | RESETA.3 13.21,4.78 15.75,4.78 RESET.3 15.85,4.78 16.46,4.78 18.29,6.6 v18.29,7.01 | X2.5 25.3,22.55 18.29,22.55 X3.1 | 19.51,40.13 22.86,40.13 23.57,39.42 24.89,39.42 J2.4 | 19.51,40.13 9.45,40.13 JP5.1 | v19.51,40.23 19.51,40.13 | ANALOG_IN.1 v48.67,40.64 | C1.1 49.07,36.58 v48.06,36.58 47.95,36.47 40.95,36.47 40.74,36.27 36.37,36.27 v36.17,36.47 | v39.42,42.27 v47.04,42.27 47.14,42.37 v50.49,42.37 | v54.66,47.04 51.71,47.04 C5.1 51.71,47.24 v50.8,48.16 | v50.8,50.8 50.7,50.9 50.49,50.9 50.29,51.1 49.38,51.1 IC3.10 | 57.61,50.09 56.49,50.09 55.98,49.58 54.66,49.58 U$12.1 | 57.61,50.09 JP2.4 | v57.61,59.13 60.35,59.13 60.66,58.83 60.86,58.83 60.86,58.42 61.06,58.22 61.67,58.22 JP3.1 | v57.61,50.19 57.61,50.09 | v35.15,7.01 34.75,6.6 33.53,6.6 OK1.7 | OK1.5 33.53,11.68 v35.15,11.68 35.36,11.48 40.44,11.48 v40.54,11.38 49.99,11.38 49.99,11.48 C2.2 | v40.44,16.36 39.62,16.36 39.62,17.48 C3.2 39.62,17.68 39.62,18.8 v39.42,18.8 | GND.GND@1 42.88,14.53 40.44,14.53 GND.GND@0 | v56.9,29.26 57.51,29.87 59.33,29.87 | 59.33,29.87 60.96,29.87 U$7.K1 | v59.74,24.49 55.27,24.49 IC1.9 55.07,24.49 v47.35,24.49 | v59.33,29.77 59.33,29.87 | IC2.15 29.36,24.99 29.36,25.5 IC2.16 | v34.65,27.53 36.58,27.53 IC2.10 36.78,27.53 38.2,27.53 38.3,27.43 38.3,27.23 C4.1 38.41,27.03 v39.52,27.03 | v34.54,24.89 29.46,24.89 IC2.15 | X2.1 39.42,22.55 45.62,22.55 X1.5 45.82,22.55 v47.35,22.55 | v25.5,24.79 25.6,24.89 29.16,24.89 IC2.15
  pour Top: 0,0 68.58,0 68.58,74.3 0,74.3
  pour Bottom: 0,0 68.58,0 68.58,74.3 0,74.3
GPA2
  Bottom 0.203: U$13.3 40.84,53.54 41.96,53.54 42.06,53.65 IC3.23
GPA3
  Bottom 0.203: U$13.4 38.1,53.34 39.93,53.34 40.84,54.25 42.06,54.25 IC3.24
GPA4
  Bottom 0.203: U$13.5 39.62,54.86 41.96,54.86 42.06,54.97 IC3.25
GPA5
  Bottom 0.203: U$13.6 38.1,55.88 39.93,55.88 40.13,55.68 42.06,55.68 IC3.26
GPA6
  Bottom 0.203: U$13.7 40.13,56.39 41.96,56.39 42.06,56.29 IC3.27
GPA7
  Bottom 0.203: U$13.8 38.1,58.42 40.64,58.42 42.06,57 IC3.28
GPB0
  Bottom 0.203: IC3.1 49.38,57 49.48,57.1 52.02,57.1 U$12.8
GPB1
  Bottom 0.203: U$12.7 53.34,55.88 51.51,55.88 51.21,56.19 49.38,56.19 IC3.2
GPB2
  Bottom 0.203: U$12.6 51.1,55.58 49.38,55.58 IC3.3
GPB3  (via drill 0.41)
  Top 0.203: v47.95,55.07 50.8,55.07 50.8,55.17 51.51,55.88 54.56,55.88 54.56,54.66 U$12.5
  Bottom 0.203: v47.95,55.07 49.28,55.07 IC3.4
GPB4
  Bottom 0.203: IC3.5 49.38,54.25 50.19,54.25 52.02,52.43 52.02,52.12 U$12.4
GPB5  (via drill 0.41)
  Top 0.203: v47.95,53.65 51.21,53.65 51.51,53.34 54.56,53.34 54.56,52.12 U$12.3
  Bottom 0.203: v47.95,53.65 49.28,53.65 IC3.6
I2C_SCL  (via drill 0.41)
  Top 0.203: v44.7,49.89 44.4,50.19 44.4,62.08 44.2,62.28 44.2,63.3 44.96,64.06 | 44.96,64.06 45.01,64.11 54.36,64.11 54.36,59.03 v53.85,58.52 | v24.59,23.98 23.47,25.09 23.47,33.33 22.86,33.93 22.86,44.7 23.37,45.21 23.37,53.03 20.32,56.08 20.32,61.27 JP4.2 | 44.96,64.06 44.2,64.82 v44.2,66.04
  Bottom 0.203: v44.7,49.89 49.17,49.89 49.28,49.78 IC3.12 | v53.85,58.52 53.95,58.42 56.08,58.42 59.23,55.27 JP2.2 | JP4.2 18.8,62.89 18.39,62.89 18.39,66.14 R2.1 18.29,66.24 17.48,66.24 17.48,68.58 17.78,68.89 41.35,68.89 v44.2,66.04 | v24.59,23.98 30.18,23.98 30.18,22.96 31.9,21.23 36.37,21.23 37.08,21.95 37.69,21.95 37.69,25.91 37.49,26.11 36.78,26.11 36.68,26.21 IC2.12
I2C_SDA  (via drill 0.41)
  Top 0.203: v30.89,26.42 31.19,26.72 31.19,32.61 32.31,33.73 35.36,33.73 35.36,41.96 v38.61,45.21 | v46.13,59.94 45.41,59.23 v45.41,47.04 | v24.28,55.98 24.28,56.69 22.86,58.12 22.86,61.27 JP4.1
  Bottom 0.203: R1.1 21.13,66.14 21.13,62.89 21.34,62.89 JP4.1 | v30.89,26.42 31.6,25.7 36.47,25.7 36.58,25.6 IC2.13 | IC3.13 49.28,49.07 48.46,49.07 46.43,47.04 v45.41,47.04 40.44,47.04 v38.61,45.21 38.61,45.31 34.95,45.31 v24.28,55.98 | v46.13,59.94 62.99,59.94 62.99,57.1 62.79,56.9 60.15,56.9 59.33,57.71 JP2.1
IN1  (via drill 0.41)
  Top 0.203: v32.92,29.26 33.73,28.45 33.73,17.27 31.5,15.04 v31.5,6.91
  Bottom 0.203: v32.92,29.26 32.61,28.96 29.46,28.96 29.36,28.85 IC2.21 | v31.5,6.91 31.5,4.06 33.43,4.06 OK1.8
IN2
  Bottom 0.203: IC2.22 29.26,29.46 29.16,29.36 23.16,29.36 16.97,23.16 16.97,15.85 33.22,15.85 34.04,15.04 34.04,12.8 32.31,12.8 32.11,12.6 32.11,9.14 33.43,9.14 OK1.6
IN4  (via drill 0.41)
  Top 0.203: v26.11,30.89 25.91,31.09 25.91,41.35 27.94,43.38 27.94,44.7 26.72,45.92 26.72,52.02 22.25,56.49 U$4.PIN6
  Bottom 0.203: v26.11,30.89 29.16,30.89 29.26,30.79 IC2.24
IN5  (via drill 0.41)
  Top 0.203: v33.12,34.44 33.02,34.54 33.02,47.24 25.7,54.56 25.7,56.49 U$4.PIN5
  Bottom 0.203: v33.12,34.44 30.18,31.5 29.36,31.5 IC2.25
IN6  (via drill 0.41)
  Top 0.203: v24.08,33.73 23.98,33.83 23.98,41.96 25.4,43.38 25.4,46.02 25.6,46.23 U$4.PIN2
  Bottom 0.203: v24.08,33.73 26.42,33.73 27.94,32.21 29.16,32.21 29.26,32.11 IC2.26
IN7  (via drill 0.41)
  Top 0.203: v27.94,33.33 29.97,35.36 29.97,42.88 30.48,43.38 30.48,44.5 28.65,46.33 U$4.PIN3
  Bottom 0.203: v27.94,33.33 28.45,32.82 29.26,32.82 IC2.27
IN8  (via drill 0.41)
  Top 0.203: v20.73,34.44 20.32,34.85 20.32,44.5 22.15,46.33 U$4.PIN1
  Bottom 0.203: v20.73,34.44 28.25,34.44 29.26,33.43 IC2.28
LOCK1_SET  (via drill 0.61)
  Top 0.406: v25.6,7.11 25.2,7.52 v25.2,18.49
  Bottom 0.406: v25.6,7.11 24.49,7.11 23.98,6.6 OK1.2 | v25.2,18.49 26.72,20.02 54.76,20.02 55.47,20.73 55.47,21.34 54.25,22.55 52.73,22.55 X1.3
LOCK2_SET  (via drill 0.61)
  Top 0.406: v26.11,11.99 26.31,12.19 26.31,16.26 32.31,22.25 32.31,22.55 X2.3
  Bottom 0.406: v26.11,11.99 24.28,11.99 23.98,11.68 OK1.4
N$1
  Top 0.305: D3.2 48.97,27.23 49.89,28.14 49.89,29.57 51.41,31.09 51.41,32.61 51.61,32.82 53.95,32.82 53.95,28.45 52.73,27.23 D2.2 52.83,27.13 54.05,25.91 54.05,21.44 53.95,21.34 53.95,20.73 54.36,20.32 55.47,20.32 55.47,21.74 56.19,22.45 X1.2 56.29,22.66 56.29,26.92 56.49,27.13 D1.2
N$2
  Top 0.203: JP9.1 58.12,39.42 54.66,42.88 54.66,43.89 JP8.1
N$3  (via drill 0.41)
  Top 0.203: v40.64,59.54 v40.64,39.73 | v65.23,53.85 v65.23,61.37
  Bottom 0.203: v40.64,39.73 40.64,37.59 39.83,36.78 38.91,36.78 38.41,37.29 32.92,37.29 31.09,35.46 26.52,35.46 26.31,35.66 20.02,35.66 17.98,33.63 10.57,33.63 9.45,32.51 JP5.4 | v40.64,59.54 41.76,60.66 51.51,60.66 52.22,61.37 v65.23,61.37 | v65.23,53.85 61.98,50.6 61.77,50.6 JP3.4
N$4  (via drill 0.41)
  Top 0.203: v53.03,34.65 58.73,34.65 58.73,30.28 58.42,29.97 58.42,16.56 56.9,15.04 56.9,9.96 55.27,8.33 55.27,7.62 K1.16
  Bottom 0.203: v53.03,34.65 45.21,34.65 IC1.18
N$5  (via drill 0.3)
  Top 0.305: 32.31,25.6 30.18,25.6 28.65,27.13 D6.2 | 32.31,25.6 32.31,27.13 D5.2 | D4.2 36.17,27.13 35.97,26.92 35.97,22.66 X2.2 | 32.31,25.6 33.12,24.79 v33.12,24.18
  Bottom 0.305: v33.12,24.18 34.65,22.66 35.87,22.66 X2.2
N$6  (via drill 0.41)
  Top 0.203: v41.96,33.43 43.69,31.7 v43.69,21.74 | v54.66,21.03 54.56,21.13 54.56,33.02 v53.65,33.93
  Bottom 0.203: v41.96,33.43 36.68,33.43 IC2.1 | v43.69,21.74 44.4,21.03 v54.66,21.03 | v53.65,33.93 54.25,34.54 55.17,34.54 IC1.1
N$7
  Bottom 0.203: R4.1 63.7,33.63 62.48,32.41 61.06,32.41 U$7.A2
N$8  (via drill 0.41)
  Top 0.203: v57.91,8.74 61.87,12.7 61.87,13.92 61.98,14.02 61.98,19.3 64.21,21.54 v64.21,45.52
  Bottom 0.203: v57.91,8.74 52.02,2.85 6.81,2.85 6.81,27.33 9.35,29.87 JP5.5 | JP3.5 v64.21,45.52
N$9  (via drill 0.41)
  Top 0.203: v38.1,21.34 38.61,20.83 38.61,18.49 39.93,17.17 41.66,17.17 41.66,13.01 41.35,12.7 41.35,9.65 39.32,7.62 K2.16
  Bottom 0.203: v38.1,21.34 38.1,23.16 40.23,25.3 43.18,25.3 43.18,31.9 43.99,32.72 44.5,32.72 45.11,33.33 IC1.17
N$10
  Top 0.203: JP9.2 55.58,39.42 52.12,42.88 52.12,43.89 JP8.2
N$11
  Bottom 0.203: R3.1 65.33,33.63 62.69,30.99 62.69,27.33 61.06,27.33 U$7.A3
N$12  (via drill 0.41)
  Top 0.203: v33.93,56.08 v33.93,40.54 | v56.59,59.23 57.3,59.94 62.99,59.94 62.99,56.9 JP3.2
  Bottom 0.203: v33.93,40.54 31.8,38.41 10.26,38.41 9.45,37.59 JP5.2 | v33.93,56.08 36.68,58.83 45.31,58.83 45.82,58.32 51.41,58.32 52.32,59.23 v56.59,59.23
N$13  (via drill 0.41)
  Top 0.203: v41.35,32.72 41.76,32.31 41.76,20.02 v42.57,19.2 | v55.37,19.51 58.01,22.15 v58.01,31.6
  Bottom 0.203: v41.35,32.72 36.68,32.72 IC2.2 | v42.57,19.2 42.88,19.51 v55.37,19.51 | v58.01,31.6 56.29,33.33 55.27,33.33 IC1.2
N$14  (via drill 0.41)
  Top 0.203: v38.51,32 39.93,30.58 39.93,30.28 40.74,29.46 41.35,29.46 41.35,19.1 43.08,17.37 48.46,17.37 48.46,20.02 50.6,22.15 v50.6,28.04
  Bottom 0.203: v38.51,32 36.68,32 IC2.3 | v50.6,28.04 54.56,32 55.17,32 IC1.3
N$16  (via drill 0.41)
  Top 0.203: v42.47,31.29 42.77,30.99 42.77,20.02 v43.99,18.8
  Bottom 0.203: v42.47,31.29 36.78,31.29 36.68,31.39 IC2.4 | v43.99,18.8 57.81,18.8 61.06,22.05 61.06,26.01 60.45,26.01 59.64,26.82 59.64,28.55 61.47,28.55 62.28,29.36 62.28,31.09 58.52,31.09 58.32,30.89 55.27,30.89 IC1.4
N$20
  Bottom 0.203: R5.1 21.03,9.25 21.13,9.14 23.88,9.14 OK1.3
N$23
  Bottom 0.203: R18.1 21.34,4.17 21.44,4.06 23.88,4.06 OK1.1
N$45  (via drill 0.41)
  Top 0.203: v56.69,8.74 59.44,11.48 59.44,17.37 62.89,20.83 62.89,43.48 61.77,44.6 61.77,45.41 JP3.6
  Bottom 0.203: v56.69,8.74 39.22,8.74 38.41,7.92 19.51,7.92 16.36,11.07 11.99,11.07 11.99,24.79 9.45,27.33 JP5.6
RELAY1  (via drill 0.3)
  Top 0.305: v57,16.36 51.31,22.05 51.31,29.87 52.63,31.19 D2.1
  Bottom 0.305: v57,16.36 64.62,16.36 64.62,14.02 63.8,13.21 63.3,13.21 62.79,12.7 K1.S1
RELAY2  (via drill 0.3)
  Top 0.305: v54.66,17.68 53.85,18.49 53.85,18.69 49.38,18.69 48.97,18.29 48.97,14.73 46.94,12.7 K2.S1 | v59.03,17.88 62.28,21.13 v62.28,37.9 | v38.71,43.79 36.98,42.06 v36.98,34.85 | v33.83,32.72 32.41,31.29 D5.1
  Bottom 0.305: v54.66,17.68 54.86,17.88 v59.03,17.88 | v62.28,37.9 57.61,42.57 51.51,42.57 50.29,43.79 v38.71,43.79 | v36.98,34.85 36.07,33.93 35.05,33.93 v33.83,32.72
RES  (via drill 0.41)
  Top 0.203: 15.75,9.86 13.21,9.86 RESETA.1 | v17.48,12.8 15.75,11.07 15.75,9.86 | 15.75,9.86 RESET.1
  Bottom 0.203: v17.48,12.8 30.99,12.8 32.72,14.53 GND.RES

### Text on the board
_tsilk: SCL SDA | OLED I2C Module | ANTENNA
_bsilk: SKAARHOJ 2013 | PCB-CARDLOCK v09-13